# Altium schematic sheet 05 lpddr4 ram.SchDoc
size A3; SheetNumber: 9; SheetTotal: 16
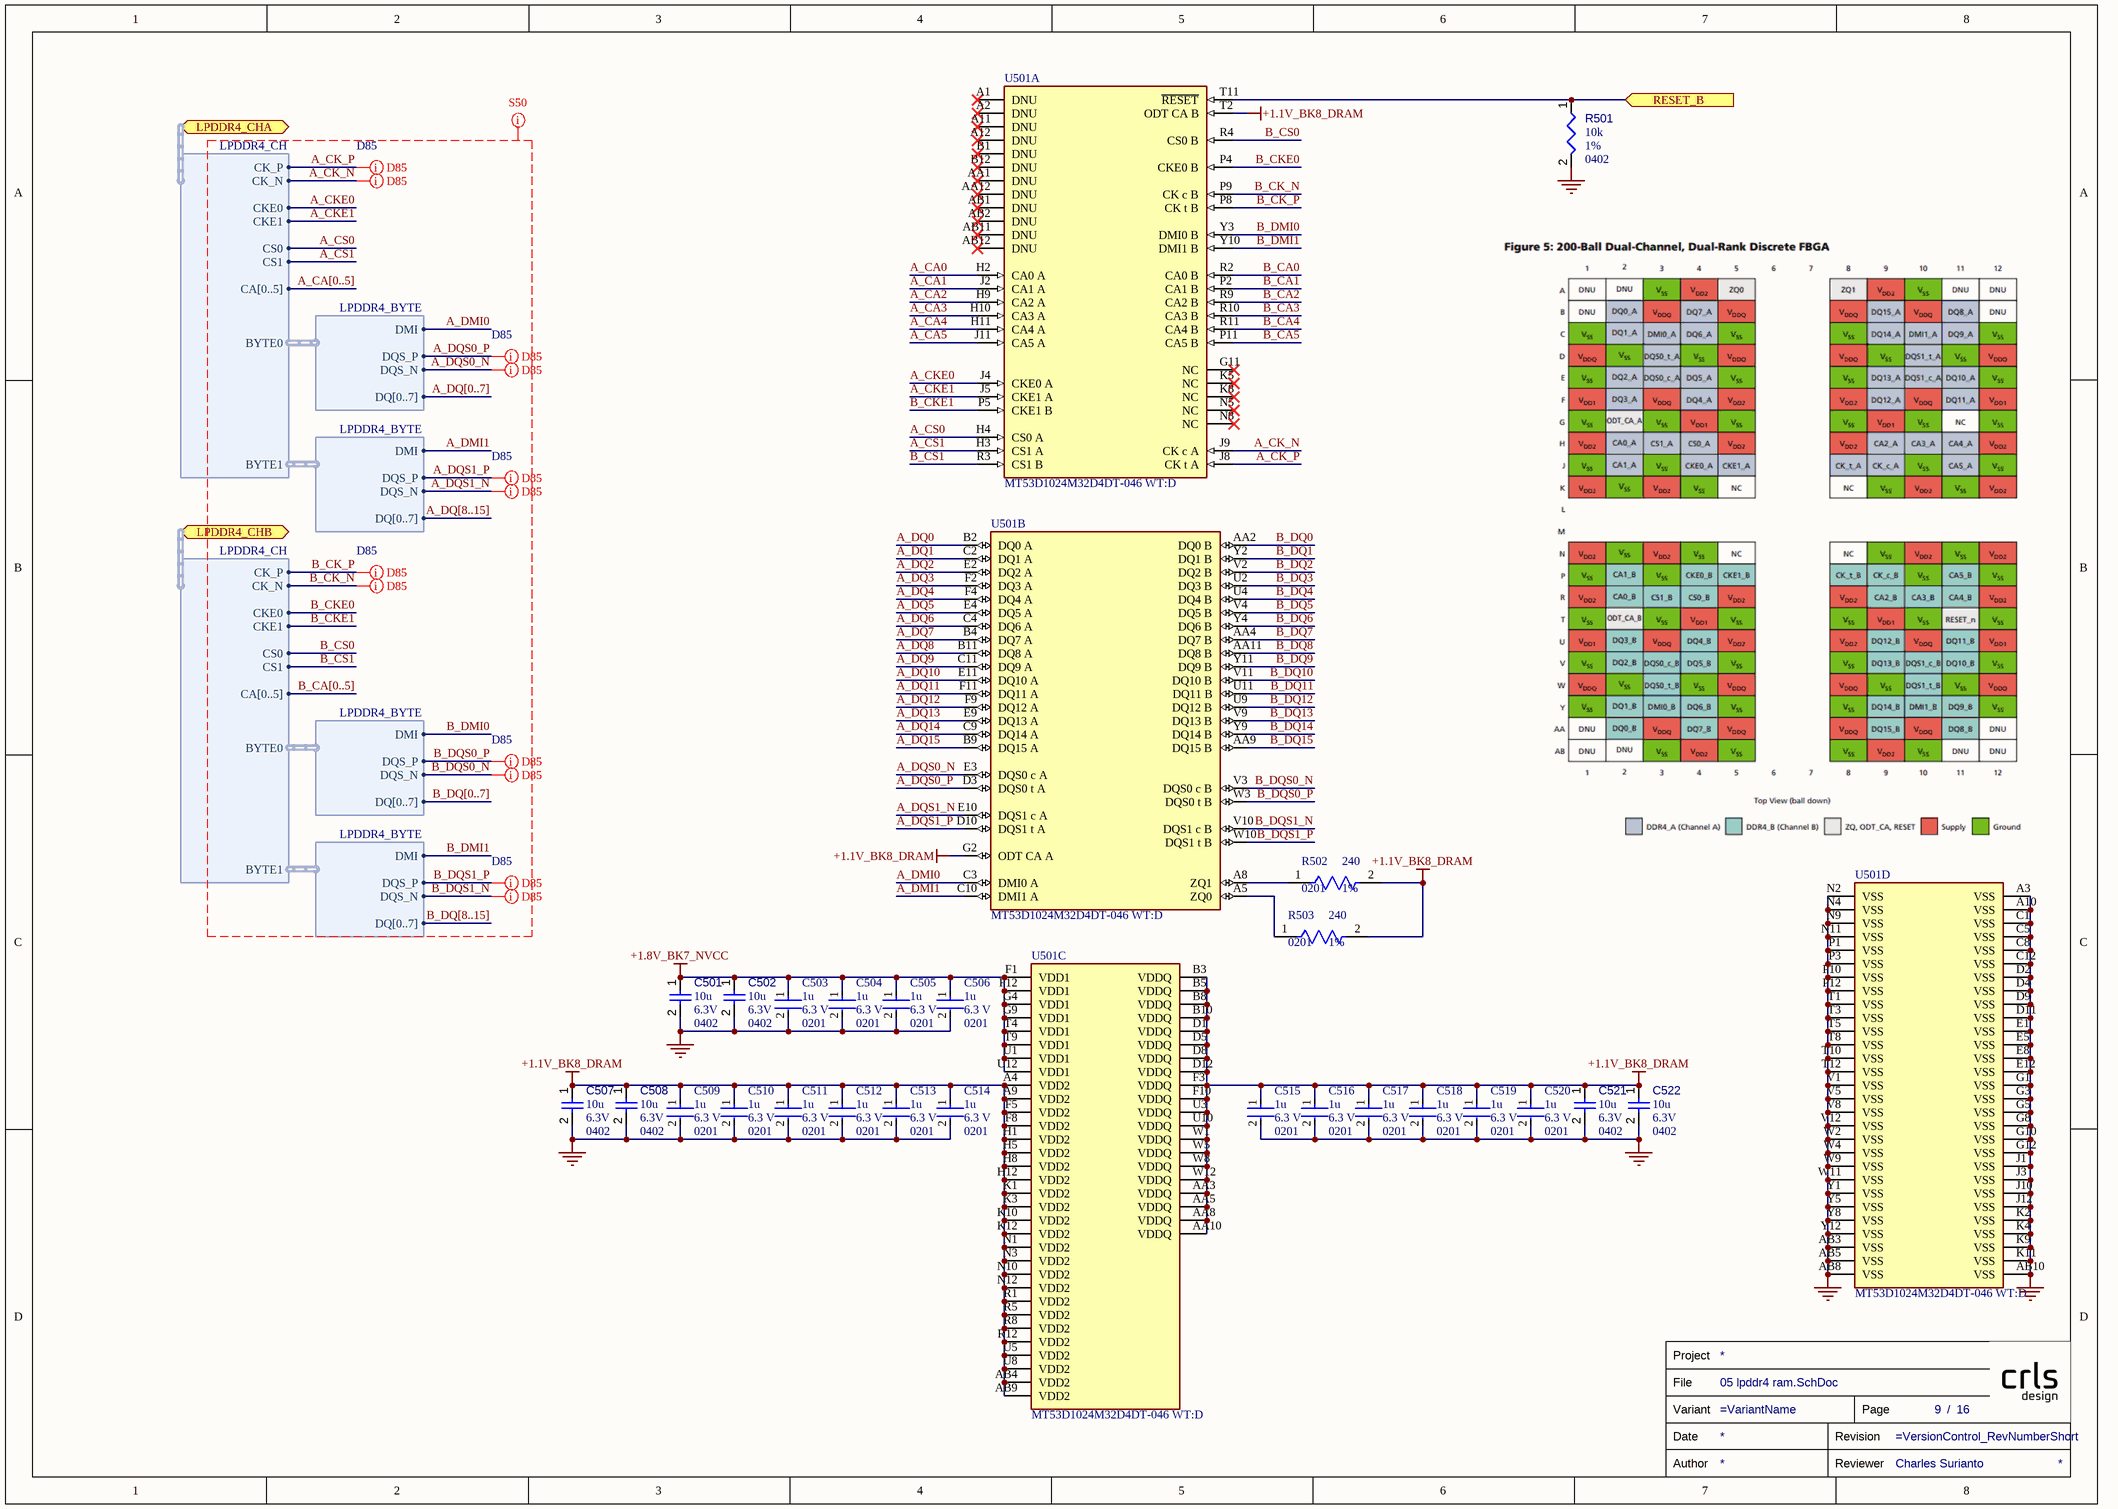
[diagram p0: 05 lpddr4 ram.SchDoc]

## Parts
C501  value 10u  Case/Package: 0402  Voltage Rating: 6.3V  [CAPC0402(1005)60_L]  (hidden comment: Capacitors,0402,10u,6.3V)
C502  value 10u  Case/Package: 0402  Voltage Rating: 6.3V  [CAPC0402(1005)60_L]  (hidden comment: Capacitors,0402,10u,6.3V)
C503  Package: 0201  Capacitance: 1u  Voltage Rating: 6.3 V  [FP-CC0201-BA-MFG]  (hidden comment: CC0201MRX5R5BB105)
C504  Package: 0201  Capacitance: 1u  Voltage Rating: 6.3 V  [FP-CC0201-BA-MFG]  (hidden comment: CC0201MRX5R5BB105)
C505  Package: 0201  Capacitance: 1u  Voltage Rating: 6.3 V  [FP-CC0201-BA-MFG]  (hidden comment: CC0201MRX5R5BB105)
C506  Package: 0201  Capacitance: 1u  Voltage Rating: 6.3 V  [FP-CC0201-BA-MFG]  (hidden comment: CC0201MRX5R5BB105)
C507  value 10u  Case/Package: 0402  Voltage Rating: 6.3V  [CAPC0402(1005)60_L]  (hidden comment: Capacitors,0402,10u,6.3V)
C508  value 10u  Case/Package: 0402  Voltage Rating: 6.3V  [CAPC0402(1005)60_L]  (hidden comment: Capacitors,0402,10u,6.3V)
C509  Package: 0201  Capacitance: 1u  Voltage Rating: 6.3 V  [FP-CC0201-BA-MFG]  (hidden comment: CC0201MRX5R5BB105)
C510  Package: 0201  Capacitance: 1u  Voltage Rating: 6.3 V  [FP-CC0201-BA-MFG]  (hidden comment: CC0201MRX5R5BB105)
C511  Package: 0201  Capacitance: 1u  Voltage Rating: 6.3 V  [FP-CC0201-BA-MFG]  (hidden comment: CC0201MRX5R5BB105)
C512  Package: 0201  Capacitance: 1u  Voltage Rating: 6.3 V  [FP-CC0201-BA-MFG]  (hidden comment: CC0201MRX5R5BB105)
C513  Package: 0201  Capacitance: 1u  Voltage Rating: 6.3 V  [FP-CC0201-BA-MFG]  (hidden comment: CC0201MRX5R5BB105)
C514  Package: 0201  Capacitance: 1u  Voltage Rating: 6.3 V  [FP-CC0201-BA-MFG]  (hidden comment: CC0201MRX5R5BB105)
C515  Package: 0201  Capacitance: 1u  Voltage Rating: 6.3 V  [FP-CC0201-BA-MFG]  (hidden comment: CC0201MRX5R5BB105)
C516  Package: 0201  Capacitance: 1u  Voltage Rating: 6.3 V  [FP-CC0201-BA-MFG]  (hidden comment: CC0201MRX5R5BB105)
C517  Package: 0201  Capacitance: 1u  Voltage Rating: 6.3 V  [FP-CC0201-BA-MFG]  (hidden comment: CC0201MRX5R5BB105)
C518  Package: 0201  Capacitance: 1u  Voltage Rating: 6.3 V  [FP-CC0201-BA-MFG]  (hidden comment: CC0201MRX5R5BB105)
C519  Package: 0201  Capacitance: 1u  Voltage Rating: 6.3 V  [FP-CC0201-BA-MFG]  (hidden comment: CC0201MRX5R5BB105)
C520  Package: 0201  Capacitance: 1u  Voltage Rating: 6.3 V  [FP-CC0201-BA-MFG]  (hidden comment: CC0201MRX5R5BB105)
C521  value 10u  Case/Package: 0402  Voltage Rating: 6.3V  [CAPC0402(1005)60_L]  (hidden comment: Capacitors,0402,10u,6.3V)
C522  value 10u  Case/Package: 0402  Voltage Rating: 6.3V  [CAPC0402(1005)60_L]  (hidden comment: Capacitors,0402,10u,6.3V)
R501  value 10k  Case/Package: 0402  Tolerance: 1%  [RESC0402(1005)_L]  (hidden comment: Resistors,0402,1%,10k)
R502  Tolerance: 1%  Case/Package: 0201  Resistance: 240  [FP-RMCF0201-MFG]  (hidden comment: RMCF0201FG240R)
R503  Tolerance: 1%  Case/Package: 0201  Resistance: 240  [FP-RMCF0201-MFG]  (hidden comment: RMCF0201FG240R)
TB?  Reviewer: Charles Surianto  (hidden comment: TITLE_BLOCK)  (graphical)
U501  MT53D1024M32D4DT-046 WT:D  [FP-DT-IPC_C]  (parts A,B,C,D of 4)

## Ports
LPDDR4_CHA (bidir, harness LPDDR4_CH), LPDDR4_CHB (bidir, harness LPDDR4_CH), RESET_B (in)

## Harnesses
LPDDR4_CH: CK_P, CK_N, CKE0, CKE1, CA[0..5], CS1, CS0, BYTE0, BYTE1
LPDDR4_BYTE: DMI, DQS_P, DQS_N, DQ[0..7]

## Nets
+1.1V_BK8_DRAM: C507.1 C508.1 C509.1 C510.1 C511.1 C512.1 C513.1 C514.1 C515.1 C516.1 C517.1 C518.1 C519.1 C520.1 C521.1 C522.1 R502.2 R503.2 U501.A4(VDD2) U501.A9(VDD2) U501.AA3(VDDQ) U501.AA5(VDDQ) U501.AA8(VDDQ) U501.AA10(VDDQ) U501.AB4(VDD2) U501.AB9(VDD2) U501.B3(VDDQ) U501.B5(VDDQ) U501.B8(VDDQ) U501.B10(VDDQ) U501.D1(VDDQ) U501.D5(VDDQ) U501.D8(VDDQ) U501.D12(VDDQ) U501.F3(VDDQ) U501.F5(VDD2) U501.F8(VDD2) U501.F10(VDDQ) U501.G2(ODT_CA_A) U501.H1(VDD2) U501.H5(VDD2) U501.H8(VDD2) U501.H12(VDD2) U501.K1(VDD2) U501.K3(VDD2) U501.K10(VDD2) U501.K12(VDD2) U501.N1(VDD2) U501.N3(VDD2) U501.N10(VDD2) U501.N12(VDD2) U501.R1(VDD2) U501.R5(VDD2) U501.R8(VDD2) U501.R12(VDD2) U501.T2(ODT_CA_B) U501.U3(VDDQ) U501.U5(VDD2) U501.U8(VDD2) U501.U10(VDDQ) U501.W1(VDDQ) U501.W5(VDDQ) U501.W8(VDDQ) U501.W12(VDDQ)
+1.8V_BK7_NVCC: C501.1 C502.1 C503.1 C504.1 C505.1 C506.1 U501.F1(VDD1) U501.F12(VDD1) U501.G4(VDD1) U501.G9(VDD1) U501.T4(VDD1) U501.T9(VDD1) U501.U1(VDD1) U501.U12(VDD1)
GND: C501.2 C502.2 C503.2 C504.2 C505.2 C506.2 C507.2 C508.2 C509.2 C510.2 C511.2 C512.2 C513.2 C514.2 C515.2 C516.2 C517.2 C518.2 C519.2 C520.2 C521.2 C522.2 R501.2 U501.A3(VSS) U501.A10(VSS) U501.AB3(VSS) U501.AB5(VSS) U501.AB8(VSS) U501.AB10(VSS) U501.C1(VSS) U501.C5(VSS) U501.C8(VSS) U501.C12(VSS) U501.D2(VSS) U501.D4(VSS) U501.D9(VSS) U501.D11(VSS) U501.E1(VSS) U501.E5(VSS) U501.E8(VSS) U501.E12(VSS) U501.G1(VSS) U501.G3(VSS) U501.G5(VSS) U501.G8(VSS) U501.G10(VSS) U501.G12(VSS) U501.J1(VSS) U501.J3(VSS) U501.J10(VSS) U501.J12(VSS) U501.K2(VSS) U501.K4(VSS) U501.K9(VSS) U501.K11(VSS) U501.N2(VSS) U501.N4(VSS) U501.N9(VSS) U501.N11(VSS) U501.P1(VSS) U501.P3(VSS) U501.P10(VSS) U501.P12(VSS) U501.T1(VSS) U501.T3(VSS) U501.T5(VSS) U501.T8(VSS) U501.T10(VSS) U501.T12(VSS) U501.V1(VSS) U501.V5(VSS) U501.V8(VSS) U501.V12(VSS) U501.W2(VSS) U501.W4(VSS) U501.W9(VSS) U501.W11(VSS) U501.Y1(VSS) U501.Y5(VSS) U501.Y8(VSS) U501.Y12(VSS)
A_CA0: U501.H2(CA0_A)
A_CA1: U501.J2(CA1_A)
A_CA2: U501.H9(CA2_A)
A_CA3: U501.H10(CA3_A)
A_CA4: U501.H11(CA4_A)
A_CA5: U501.J11(CA5_A)
A_CK_N: U501.J9(CK_c_A) ; port LPDDR4_CHA.CK_N
A_CK_P: U501.J8(CK_t_A) ; port LPDDR4_CHA.CK_P
A_CKE0: U501.J4(CKE0_A) ; port LPDDR4_CHA.CKE0
A_CKE1: U501.J5(CKE1_A) ; port LPDDR4_CHA.CKE1
A_CS0: U501.H4(CS0_A) ; port LPDDR4_CHA.CS0
A_CS1: U501.H3(CS1_A) ; port LPDDR4_CHA.CS1
A_DMI0: U501.C3(DMI0_A) ; harness LPDDR4_BYTE.DMI
A_DMI1: U501.C10(DMI1_A) ; harness LPDDR4_BYTE.DMI
A_DQ0: U501.B2(DQ0_A)
A_DQ1: U501.C2(DQ1_A)
A_DQ2: U501.E2(DQ2_A)
A_DQ3: U501.F2(DQ3_A)
A_DQ4: U501.F4(DQ4_A)
A_DQ5: U501.E4(DQ5_A)
A_DQ6: U501.C4(DQ6_A)
A_DQ7: U501.B4(DQ7_A)
A_DQ8: U501.B11(DQ8_A)
A_DQ9: U501.C11(DQ9_A)
A_DQ10: U501.E11(DQ10_A)
A_DQ11: U501.F11(DQ11_A)
A_DQ12: U501.F9(DQ12_A)
A_DQ13: U501.E9(DQ13_A)
A_DQ14: U501.C9(DQ14_A)
A_DQ15: U501.B9(DQ15_A)
A_DQS0_N: U501.E3(DQS0_c_A) ; harness LPDDR4_BYTE.DQS_N
A_DQS0_P: U501.D3(DQS0_t_A) ; harness LPDDR4_BYTE.DQS_P
A_DQS1_N: U501.E10(DQS1_c_A) ; harness LPDDR4_BYTE.DQS_N
A_DQS1_P: U501.D10(DQS1_t_A) ; harness LPDDR4_BYTE.DQS_P
B_CA0: U501.R2(CA0_B)
B_CA1: U501.P2(CA1_B)
B_CA2: U501.R9(CA2_B)
B_CA3: U501.R10(CA3_B)
B_CA4: U501.R11(CA4_B)
B_CA5: U501.P11(CA5_B)
B_CK_N: U501.P9(CK_c_B) ; port LPDDR4_CHB.CK_N
B_CK_P: U501.P8(CK_t_B) ; port LPDDR4_CHB.CK_P
B_CKE0: U501.P4(CKE0_B) ; port LPDDR4_CHB.CKE0
B_CKE1: U501.P5(CKE1_B) ; port LPDDR4_CHB.CKE1
B_CS0: U501.R4(CS0_B) ; port LPDDR4_CHB.CS0
B_CS1: U501.R3(CS1_B) ; port LPDDR4_CHB.CS1
B_DMI0: U501.Y3(DMI0_B) ; harness LPDDR4_BYTE.DMI
B_DMI1: U501.Y10(DMI1_B) ; harness LPDDR4_BYTE.DMI
B_DQ0: U501.AA2(DQ0_B)
B_DQ1: U501.Y2(DQ1_B)
B_DQ2: U501.V2(DQ2_B)
B_DQ3: U501.U2(DQ3_B)
B_DQ4: U501.U4(DQ4_B)
B_DQ5: U501.V4(DQ5_B)
B_DQ6: U501.Y4(DQ6_B)
B_DQ7: U501.AA4(DQ7_B)
B_DQ8: U501.AA11(DQ8_B)
B_DQ9: U501.Y11(DQ9_B)
B_DQ10: U501.V11(DQ10_B)
B_DQ11: U501.U11(DQ11_B)
B_DQ12: U501.U9(DQ12_B)
B_DQ13: U501.V9(DQ13_B)
B_DQ14: U501.Y9(DQ14_B)
B_DQ15: U501.AA9(DQ15_B)
B_DQS0_N: U501.V3(DQS0_c_B) ; harness LPDDR4_BYTE.DQS_N
B_DQS0_P: U501.W3(DQS0_t_B) ; harness LPDDR4_BYTE.DQS_P
B_DQS1_N: U501.V10(DQS1_c_B) ; harness LPDDR4_BYTE.DQS_N
B_DQS1_P: U501.W10(DQS1_t_B) ; harness LPDDR4_BYTE.DQS_P
RESET_B: R501.1 U501.T11(~{RESET}) ; port RESET_B
NetR502_1: R502.1 U501.A8(ZQ1)
NetR503_1: R503.1 U501.A5(ZQ0)

Not connected (* = marked no-connect by the designer): U501 A1(DNU)* A2(DNU)* A11(DNU)* A12(DNU)* AA1(DNU)* AA12(DNU)* AB1(DNU)* AB2(DNU)* AB11(DNU)* AB12(DNU)* B1(DNU)* B12(DNU)* G11(NC)* K5(NC)* K8(NC)* N5(NC)* N8(NC)*

## Buses and harness runs
bus A_CA[0..5]
bus A_DQ[0..7]
bus A_DQ[8..15]
bus B_CA[0..5]
bus B_DQ[0..7]
bus B_DQ[8..15]

## Layout directives
net class S50: A_CA[0..5], A_CK_N, A_CK_P, A_CKE0, A_CKE1, A_CS0, A_CS1, A_DMI0, A_DMI1, A_DQ[0..7], A_DQ[8..15], A_DQS0_N, A_DQS0_P, A_DQS1_N, A_DQS1_P, B_CA[0..5], B_CK_N, B_CK_P, B_CKE0, B_CKE1, B_CS0, B_CS1, B_DMI0, B_DMI1, B_DQ[0..7], B_DQ[8..15], B_DQS0_N, B_DQS0_P, B_DQS1_N, B_DQS1_P
differential pair; differential pair class D85: A_CK_N, A_CK_P, A_DQS0_N, A_DQS0_P, A_DQS1_N, A_DQS1_P, B_CK_N, B_CK_P, B_DQS0_N, B_DQS0_P, B_DQS1_N, B_DQS1_P

## Notes on the sheet
- (in symbol TITLE_BLOCK) Project; File; Variant; Page; /; Date; Revision; Author; Reviewer

## Library data of the parts
C501 C502 C507 C508 C521 C522 = Capacitors: Capacitor; Component Type: Capacitors
C503-C506 C509-C520 = CMP-03422-000660-2: CAP CER 1UF 6.3V X5R 0201; Manufacturer: Yageo; Tolerance: 0.2; Material: Ceramic; Temperature Coefficient: 15%; Category: Cap; Digikey Description: CAP CER 1UF 6.3V X5R 0201; Temperature: -55°C to +85°C; Temperature Range High: +85°C; ComponentLink2Description: Datasheet; Lead Free: Yes; Height: 0.33mm; Temperature Range Low: -55°C; Temperature Characteristic: X5R; Device Class L1: Passive Components; Footprint Url: http://www.yageo.com/exep/pages/download/literatures/UPY-C_GEN_24.pdf; Value: 1 uF; Octopart: https://octopart.com/cc0201mrx5r5bb105-yageo-33242268; Manufacturer Part Number: CC0201MRX5R5BB105; Automotive: No; Mouser Description: Multilayer Ceramic Capacitors MLCC - SMD/SMT 1.0uF 6.3V X5R 20%; Device Class L3: Ceramic Capacitors; ComponentLink2URL: http://www.yageo.com/documents/recent/UPY-GPHC_X5R_4V-to-50V_25.pdf; RoHS: TRUE; Ipc Land Pattern Name: CAPC6030X30; Device Class L2: Capacitors
R501 = Resistors: Resistor; Component Type: Resistors
R502 R503 = CMP-26527-006303-1: 240Ω ±1% 0.05W 0201 Thick Film Chip Resistor AEC-Q200 compliant; Temperature Coefficient: 200ppm/°C; Max Power Dissipation: 50mW; Resistor Type: Thick Film; Case Code (Imperial): 0201; Case Code (Metric): 0603; Min Operating Temperature: -55°C; Length: 0.024inch; Packaging: Tape and Reel; Max Operating Temperature: 125°C; Number of Terminations: 2; Width: 0.012inch; Height: 0.009inch
U501 = CMP-14959-000001-1: IC DRAM LPDDR4 32G FBGA; Manufacturer: Micron; Frequency: 2133MHz; Min Supply Voltage: 0.57V; Standoff Height: 0.177mm; Memory Type: SDRAM; Max Supply Voltage: 1.95V; Automotive Grade: Grade 3; Memory Size: 32Gbits; Device Class L1: Integrated Circuits (ICs); ComponentLink2Description: Datasheet; Temperature Range High: +85°C; Manufacturer Part Number: MT53D1024M32D4DT-046 WT:D; Automotive: Yes; Package: DT; Temperature Range Low: -30°C; Ipc Land Pattern Name: BGA264N65P12X22_1450X1000X85; Category: IC; ComponentLink2URL: https://www.micron.com/products/dram/lpdram/part-catalog/mt53d1024m32d4dt-046-wt; Device Class L3: RAM; Octopart: https://octopart.com/mt53d1024m32d4dt-046+wt%3Ad-micron-92400194; Height: 0.95mm; RoHS: TRUE; Temperature: -30°C to +85°C; Digikey Description: IC DRAM LPDDR4 32G FBGA; Device Class L2: Memory; Lead Free: Yes
TB? = TITLE_BLOCK: Review Date: *